# EAGLE design GAGAN_payload_V1 (EAGLE 9.3.2)
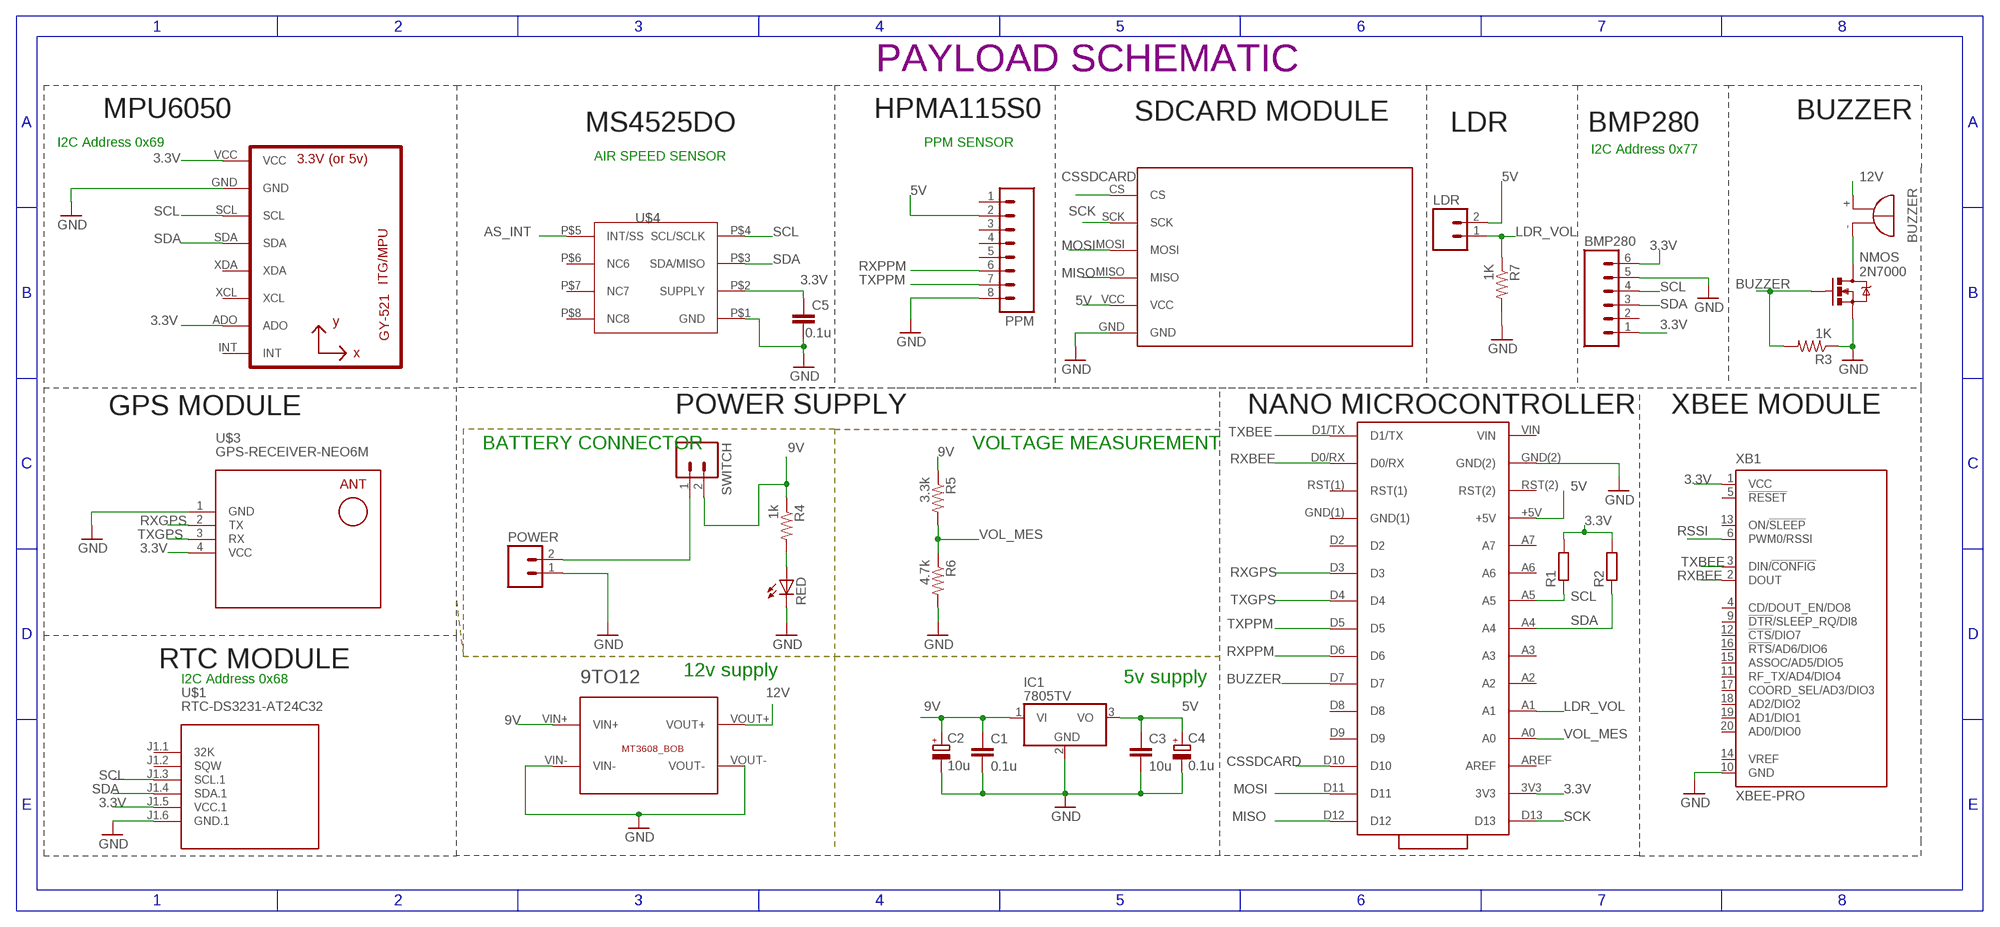
[diagram p0: schematic, sheet 1]

## Parts
9TO12  BREAKOUTS_MT3608_BOB  [BREAKOUTS_MT3608_BOB]
BMP280  M06  [06P]
C1  0.1u  C-EU025-025X050  [C025-025X050]
C2  10u  CPOL-EUE2.5-6  [E2,5-6]
C3  10u  C-EU025-025X050  [C025-025X050]
C4  0.1u  CPOL-EUE2.5-6  [E2,5-6]
C5  0.1u  C-EU025-025X050  [C025-025X050]
IC1  7805TV  [TO220V]
LDR  M02  [02P]
MOD1  ARDUINO(NANO_3.0)  [ARDUINO_NANO_30PIN]
POWER  CEDT_JANUARY_2015_V5_M02  [CEDT_JANUARY_2015_V5_02P]
PPM  M08  [08P]
Q1  SPARKFUN-DISCRETESEMI_MOSFET-NCHANNEL2N7000  [SPARKFUN-DISCRETESEMI_TO-92]
R1  R-EU_0207/7  [0207/7]
R2  R-EU_0207/7  [0207/7]
R3  1K  R-US_0204/7  [0204/7]
R4  1k  R-US_0204/7  [0204/7]
R5  3.3k  R-US_0204/7  [0204/7]
R6  4.7k  R-US_0204/7  [0204/7]
R7  1K  R-US_0204/7  [0204/7]
RED  red  LED3MM  [LED3MM]
SG1  BUZZER_EB2209A  [BUZZER_EB2209A]
SWITCH  M02  [02P]
U1  GY-521MPU6050  [GY-521]
U$1  RTC-DS3231-AT24C32  [RTC-DS3231-AT24C32]
U$3  GPS-RECEIVER-NEO6M  [GPS-RECEIVER-NEO6M]
U$4  MS4525DO  [MS4525DO]
U$5  SDCARD  [M0SDCARDMODULE]
XB1  XBEE-PRO  [XBEE-PRO]

## Nets
3.3V [power]: BMP280.1 BMP280.6 C5.1 MOD1.3V3 R1.2 R2.2 U1.ADO U1.VCC U$1.J1.5(VCC.1) U$3.4(VCC) U$4.P$2(SUPPLY) XB1.1(VCC)
5V [power]: C3.1 C4.+ IC1.3(VO) LDR.2 MOD1.+5V PPM.2 U$5.VCC
9V [power]: 9TO12.VIN+ C1.1 C2.+ IC1.1(VI) R4.1 R5.1 SWITCH.2
12V [power]: 9TO12.VOUT+ SG1.+
AS_INT: U$4.P$5(INT/SS)
BUZZER: MOD1.D7 Q1.2(G) R3.2
CSSDCARD: MOD1.D10 U$5.CS
GND [power]: 9TO12.VIN- 9TO12.VOUT- BMP280.5 C1.2 C2.- C3.2 C4.- C5.2 IC1.2(GND) MOD1.GND(2) POWER.1 PPM.8 Q1.1(S) R3.1 R6.2 R7.2 RED.K(C) U1.GND U$1.J1.6(GND.1) U$3.1(GND) U$4.P$1(GND) U$5.GND XB1.10(GND)
LDR_VOL: LDR.1 MOD1.A1 R7.1
MISO: MOD1.D12 U$5.MISO
MOSI: MOD1.D11 U$5.MOSI
N$1 [power]: POWER.2 SWITCH.1
N$2: R4.2 RED.A
N$3 [power]: Q1.3(D) SG1.-
RSSI: XB1.6(PWM0/RSSI)
RXBEE: MOD1.D0/RX XB1.2(DOUT)
RXGPS: MOD1.D3 U$3.2(TX)
RXPPM: MOD1.D6 PPM.6
SCK: MOD1.D13 U$5.SCK
SCL: BMP280.4 MOD1.A5 R1.1 U1.SCL U$1.J1.3(SCL.1) U$4.P$4(SCL/SCLK)
SDA: BMP280.3 MOD1.A4 R2.1 U1.SDA U$1.J1.4(SDA.1) U$4.P$3(SDA/MISO)
TXBEE: MOD1.D1/TX XB1.3(DIN/!CONFIG)
TXGPS: MOD1.D4 U$3.3(RX)
TXPPM: MOD1.D5 PPM.7
VOL_MES: MOD1.A0 R5.2 R6.1
Unconnected: BMP280.2 MOD1.A2 MOD1.A3 MOD1.A6 MOD1.A7 MOD1.AREF MOD1.D2 MOD1.D8 MOD1.D9 MOD1.GND(1) MOD1.RST(1) MOD1.RST(2) MOD1.VIN PPM.1 PPM.3 PPM.4 PPM.5 U1.INT U1.XCL U1.XDA U$1.J1.1(32K) U$1.J1.2(SQW) U$4.P$6(NC6) U$4.P$7(NC7) U$4.P$8(NC8) XB1.4(CD/DOUT_EN/DO8) XB1.5(!RESET) XB1.9(!DTR!/SLEEP_RQ/DI8) XB1.11(RF_TX/AD4/DIO4) XB1.12(!CTS!/DIO7) XB1.13(ON/!SLEEP) XB1.14(VREF) XB1.15(ASSOC/AD5/DIO5) XB1.16(!RTS!/AD6/DIO6) XB1.17(COORD_SEL/AD3/DIO3) XB1.18(AD2/DIO2) XB1.19(AD1/DIO1) XB1.20(AD0/DIO0)

## Notes on the sheet
- PAYLOAD SCHEMATIC
- MPU6050 | HPMA115S0 | SDCARD MODULE | BUZZER
- MS4525DO | LDR | BMP280
- I2C Address 0x69 | PPM SENSOR
- I2C Address 0x77
- AIR SPEED SENSOR
- GPS MODULE | POWER SUPPLY | NANO MICROCONTROLLER | XBEE MODULE
- BATTERY CONNECTOR | VOLTAGE MEASUREMENT
- RTC MODULE
- 12v supply
- I2C Address 0x68 | 5v supply

## Library data of the parts
9TO12 = Cansat2019_3279_Container_v01:BREAKOUTS_MT3608_BOB
BMP280 = con-amp-quick:M06: AMP QUICK CONNECTOR; OC_FARNELL: unknown; OC_NEWARK: unknown
C1 C3 C5 = resistor:C-EU: CAPACITOR, European symbol
C2 C4 = rcl:CPOL-EU: POLARIZED CAPACITOR, European symbol
IC1 = linear:78*: Positive VOLTAGE REGULATOR Source: http://cache.national.com/ds/LM/LM78L05.pdf http://www.fairchildsemi.com/ds/LM/LM7805.pdf
LDR = con-amp-quick:M02: AMP QUICK CONNECTOR; OC_FARNELL: unknown; OC_NEWARK: unknown
MOD1 = Arduino_Nano_3:ARDUINO(NANO_3.0)
POWER = Cansat2019_3279_Container_v01:CEDT_JANUARY_2015_V5_M02: AMP QUICK CONNECTOR
PPM = con-amp-quick:M08: AMP QUICK CONNECTOR; OC_FARNELL: unknown; OC_NEWARK: unknown
Q1 = Cansat2019_3279_Container_v01:SPARKFUN-DISCRETESEMI_MOSFET-NCHANNEL: Common NMOSFET Parts MFG P/N Store ID Prod ID FDD8780 TRANS-09984 SI7820DN TRANS-11055 FDS6630A IC-08089 2N7002PW TRANS-11151 FQP30N06L COM-10213 TRANS-10060 BSS123LT1G TRANS-08345 BSS138 TRANS-00830 BS170 2N7000
R1 R2 = rcl:R-EU_: RESISTOR, European symbol; SPICEPREFIX: R
R3-R7 = rcl:R-US_: RESISTOR, American symbol
RED = CEDT_JANUARY_2015_v5:LED
SG1 = Cansat2019_3279_Container_v01:BUZZER_EB2209A: BUZZER Source: Buerklin; OC_FARNELL: unknown; OC_NEWARK: unknown
SWITCH = CEDT_JANUARY_2015_v5:M02: AMP QUICK CONNECTOR
U1 = gy-521:GY-521
U$1 = diy-modules:RTC-DS3231-AT24C32: RTC Module with Battery and EEPROM based on DS3231 and AT24C32 chips Tutorial can be found here: https://edwardmallon.wordpress.com/2014/05/21/using-a-cheap-3-ds3231-rtc-at24c32-eeprom-from-ebay/ Click here to find device on ebay.com <http://www.ebay.com/sch/DS3231+AT24C32+module>
U$3 = diy-modules_modded_gps:GPS-RECEIVER-NEO6M: GPS Receiver Module based on NEO-6 device Short tutorial how to use NEO-6 module with Arduino: http://www.xarg.org/2016/06/neo6mv2-gps-module-with-arduino/ NEO-6 datasheet is available here: https://www.u-blox.com/sites/default/files/products/documents/NEO-6_DataSheet_%28GPS.G6-HW-09005%29.pdf Click here to find device on ebay.com <http://www.ebay.com/sch/gyneo6mv2>
U$4 = MS4525:MS4525DO
U$5 = mylib:SDCARD
XB1 = maxstream:XBEE: XBee (TM) /XBee-PRO(TM) OEM RF Modules Source: MaxStream, Inc. xbee_productmanual.pdf; MPN: XBP24-AWI-001; OC_FARNELL: 1337916; OC_NEWARK: 42M2667

## Net classes
0 default: width 0.61 mm
1 power: width 0.61 mm

## Board
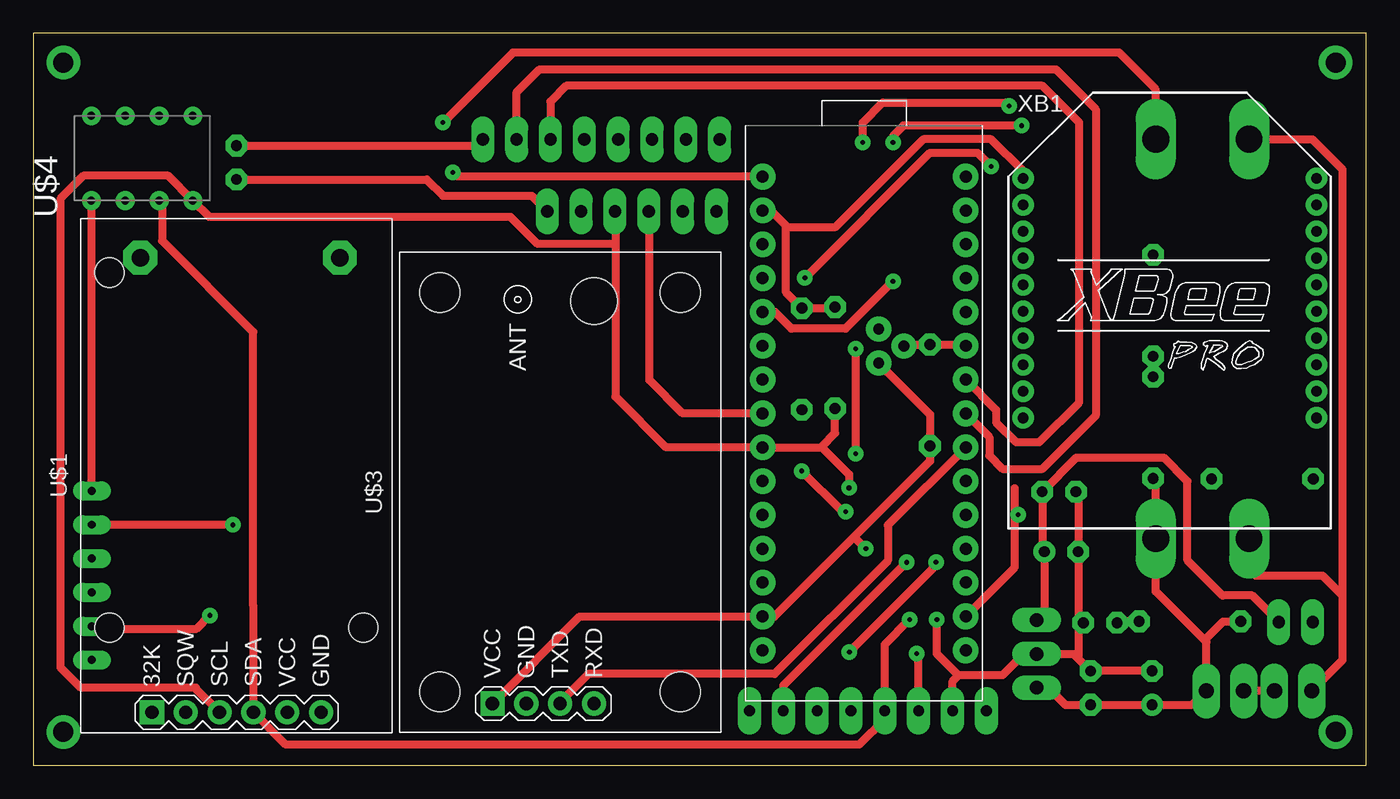
[diagram p1: board, top side]
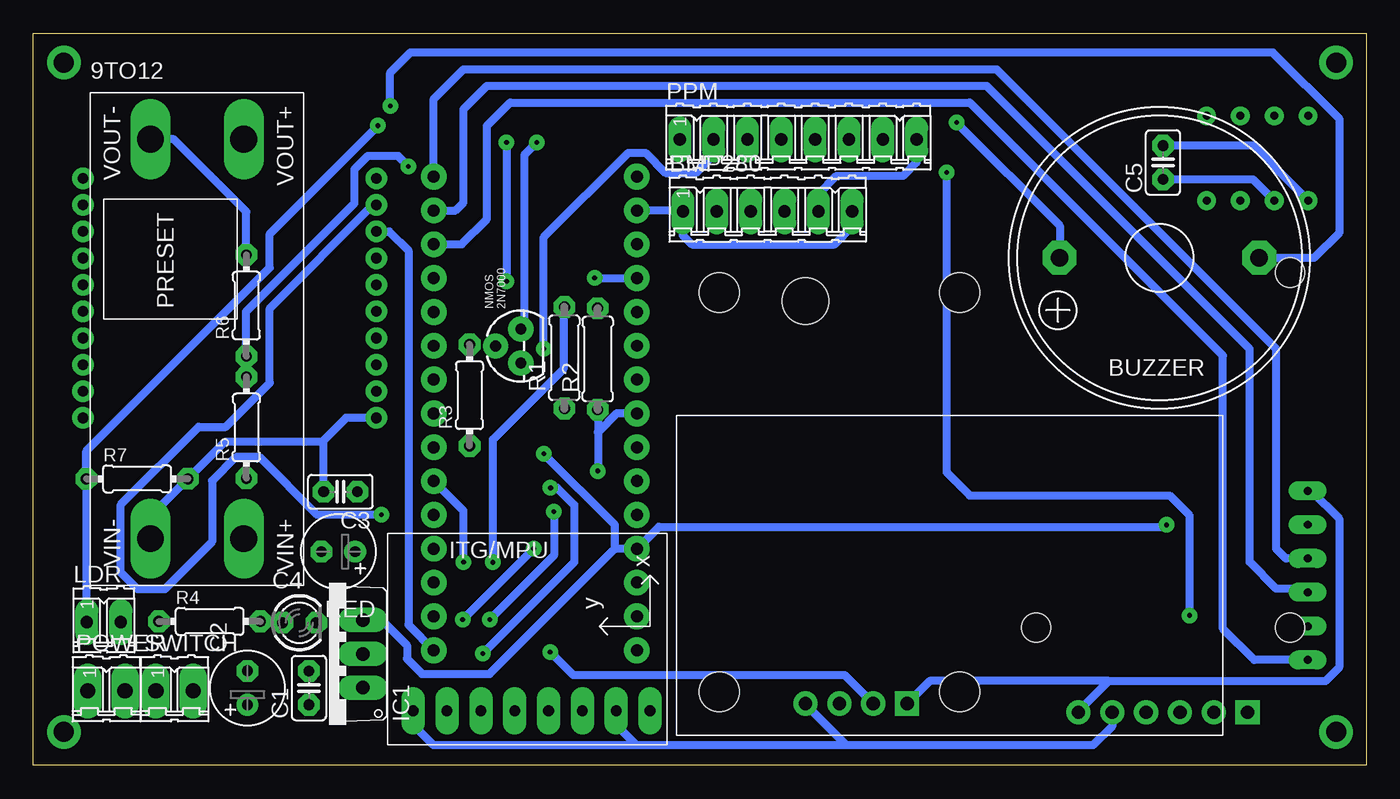
[diagram p2: board, bottom side, seen from below]

Size 100.04 x 54.95 mm. Coordinates in mm from the lower left corner, seen from the top.
Outline: 0,0 100.04,0 100.04,54.95 0,54.95 0,0
Copper layers (1*16): Top 0.035mm / dielectric 1.5mm / Bottom 0.035mm
Design rules "default *": minimum track width 6mil, minimum drill 0.35mm, track to track 16mil, track to pad 16mil, pad to pad 16mil, via to via 16mil, smd to smd 16mil, copper to edge 40mil, drill to drill 6mil, minimum pad ring 16mil, minimum via ring 16mil, stop-mask expansion 4mil, vias tented up to drill 0mil, thermal gap 10mil

### Footprints (pad centres in the part's own frame; a part is rotated, then mirrored left to right if it is on the bottom)
BREAKOUTS_MT3608_BOB = drill 2 pad 3 long: VIN+ 33.5,-4.5; VIN- 33.5,-11.5; VOUT+ 3.5,-4.5; VOUT- 3.5,-11.5
06P = drill 0.914 long: 1 -6.35,0; 2 -3.81,0; 3 -1.27,0; 4 1.27,0; 5 3.81,0; 6 6.35,0
C025-025X050 = drill 0.813 octagon: 1 -1.27,0; 2 1.27,0
E2,5-6 = drill 0.813 pad 1.6: + -1.27,0 | drill 0.813 pad 1.6 octagon: - 1.27,0
TO220V = drill 1.016 long: 1 -2.54,-2.54; 2 0,-2.54; 3 2.54,-2.54
02P = drill 0.914 long: 1 -1.27,0; 2 1.27,0
ARDUINO_NANO_30PIN = drill 0.9 pad 1.93: 3V3 16.51,6.35; +5V 16.51,31.75; A0 16.51,11.43; A1 16.51,13.97; A2 16.51,16.51; A3 16.51,19.05; A4 16.51,21.59; A5 16.51,24.13; A6 16.51,26.67; A7 16.51,29.21; AREF 16.51,8.89; D0/RX 1.27,36.83; D1/TX 1.27,39.37; D2 1.27,29.21; D3 1.27,26.67; D4 1.27,24.13; D5 1.27,21.59; D6 1.27,19.05; D7 1.27,16.51; D8 1.27,13.97; D9 1.27,11.43; D10 1.27,8.89; D11 1.27,6.35; D12 1.27,3.81; D13 16.51,3.81; GND(1) 1.27,31.75; GND(2) 16.51,36.83; RST(1) 1.27,34.29; RST(2) 16.51,34.29; VIN 16.51,39.37
CEDT_JANUARY_2015_V5_02P = drill 1.143 long: 1 -1.397,0; 2 1.397,0
08P = drill 0.914 long: 1 -8.89,0; 2 -6.35,0; 3 -3.81,0; 4 -1.27,0; 5 1.27,0; 6 3.81,0; 7 6.35,0; 8 8.89,0
SPARKFUN-DISCRETESEMI_TO-92 = drill 0.813 pad 1.88: 1 -1.27,0; 2 0,1.905; 3 1.27,0
0207/7 = drill 0.813 octagon: 1 -3.81,0; 2 3.81,0
0204/7 = drill 0.813 octagon: 1 -3.81,0; 2 3.81,0
LED3MM = drill 0.813 octagon: A -1.27,0; K 1.27,0
BUZZER_EB2209A = drill 1.321 pad 2.54 octagon: + 7.493,0; - -7.493,0
02P' = drill 1.143 long: 1 -1.397,0; 2 1.397,0
GY-521 = drill 0.8 pad 1.778 long: ADO -8.89,-6.35; GND -8.89,6.35; INT -8.89,-8.89; SCL -8.89,3.81; SDA -8.89,1.27; VCC -8.89,8.89; XCL -8.89,-3.81; XDA -8.89,-1.27
RTC-DS3231-AT24C32 = drill 1 square: J1.1 -17.78,6.35 | drill 1: J1.2 -17.78,3.81; J1.3 -17.78,1.27; J1.4 -17.78,-1.27; J1.5 -17.78,-3.81; J1.6 -17.78,-6.35 | hole 2.2: -11.43,-9.525; -11.43,9.525; 15.24,9.525
GPS-RECEIVER-NEO6M = drill 1 square: 1 -15.875,5.08 | drill 1: 2 -15.875,2.54; 3 -15.875,0; 4 -15.875,-2.54 | hole 3: -14.986,9.017; -14.986,-9.017; 14.986,-9.017; 14.986,9.017 | hole 3.5: 14.351,-2.54
MS4525DO = drill 0.6: P$1 -6.35,8.89; P$2 -6.35,6.35; P$3 -6.35,3.81; P$4 -6.35,1.27; P$5 0,8.89; P$6 0,6.35; P$7 0,3.81; P$8 0,1.27
M0SDCARDMODULE = drill 0.6 long: CS -6.35,6.35; GND -6.35,-6.35; MISO -6.35,-1.27; MOSI -6.35,1.27; SCK -6.35,3.81; VCC -6.35,-3.81
XBEE-PRO = drill 0.8 pad 1.27: 1 -11,9; 2 -11,7; 3 -11,5; 4 -11,3; 5 -11,1; 6 -11,-1; 7 -11,-3; 8 -11,-5; 9 -11,-7; 10 -11,-9; 11 11,-9; 12 11,-7; 13 11,-5; 14 11,-3; 15 11,-1; 16 11,1; 17 11,3; 18 11,5; 19 11,7; 20 11,9

### Placement (x,y rotation side)
9TO12  79.75,50.5 270 bottom
BMP280  44.93,41.58 0 bottom
C1  79.35,5.8 90 bottom
C2  83.97,5.81 90 bottom
C3  76.99,20.53 180 bottom
C4  77.15,16.03 180 bottom
C5  15.25,45.25 90 bottom
IC1  77.84,8.36 90 bottom
LDR  94.75,10.75 0 bottom
MOD1  71.25,48 180 top
POWER  94.55,5.58 0 bottom
PPM  42.63,46.99 0 bottom
Q1  63.45,31.47 90 bottom
R1  60.18,30.59 90 bottom
R2  57.68,30.5 90 bottom
R3  67.3,27.78 90 bottom
R4  86.81,10.8 0 bottom
R5  84.05,25.35 90 bottom
R6  84.05,34.51 90 bottom
R7  92.25,21.5 0 bottom
RED  80.07,10.7 0 bottom
SG1  15.52,38.1 180 bottom
SWITCH  [02P']  89.44,5.58 0 bottom
U1  62.64,12.97 90 bottom
U$1  15.25,21.75 90 top
U$3  39.54,20.5 90 top
U$4  13.25,48.75 90 top
U$5  10.75,14.25 180 bottom
XB1  85.3,35.07 0 top

### Tracks (layer width: path | path; a pad name or v marks a point on that pad's centre or on a via)
3.3V  (via drill 0.35)
  Top 0.61: 56.5,40.4 56.5,35.49 R2.2 60.09,34.31 R1.2 | MOD1.3V3 55.35,41.65 56.5,40.5 56.5,40.4 | U1.ADO 56.29,5.98 v65.54,15.23 | 56.5,40.4 60.21,40.4 66.81,47 71.89,47 74.3,44.59 XB1.1 | C5.1 29.52,43.98 30.75,42.75 37.41,42.75 BMP280.6
  Bottom 0.61: v65.54,15.23 65.54,24.46 60.21,29.79 60.21,34.43 R1.2 | MOD1.3V3 51.35,41.65 BMP280.1 51.28,39.78 50.6,39.1 39.9,39.1 38.58,40.42 BMP280.6 | U$4.P$2 8.48,43.98 C5.1 | U$1.J1.5 19.06,2.94 20.5,1.5 39,1.5 | 39,1.5 42.08,4.58 U$3.4 | 39,1.5 54.75,1.5 | 54.75,1.5 56.29,3.04 U1.ADO | 54.75,1.5 70,1.5 71.53,3.03 U1.VCC
5V  (via drill 0.35)
  Top 0.61: IC1.3 75.88,11.48 C4.+ 75.72,16.19 C3.1 78.28,23.09 84.84,23.09 86.62,21.32 86.62,15.38 89.25,12.75 91.48,12.75 LDR.2 | v14.99,18.05 4.41,18.05 U$5.VCC | v61.73,23.38 v61.73,31.25
  Bottom 0.61: 56.39,16.24 56.4,16.24 65.79,6.85 70.87,6.85 70.87,6.87 72,8 72,9 73.9,10.9 IC1.3 | v61.73,31.25 61.73,39.64 55.38,45.99 54.11,45.99 52.58,44.46 50.3,44.46 48.98,45.79 PPM.2 | v61.73,23.38 56.39,18.05 56.39,16.24 | 56.39,16.24 MOD1.+5V 53.09,17.9 15.14,17.9 v14.99,18.05
9V
  Top 0.61: IC1.1 76.18,5.82 77.47,4.53 C1.1 C2.+ 87,4.54 SWITCH.2 88.04,9.25 | 88.04,9.25 88.04,9.54 89.3,10.8 R4.1 | 88.04,9.25 84.25,13.04 9TO12.VIN+ 84.25,21.34 R5.1
12V  (via drill 0.35)
  Top 0.61: 9TO12.VOUT+ 84.25,50.75 81.5,53.5 36,53.5 v30.75,48.25
  Bottom 0.61: v30.75,48.25 23,40.5 23,38.11 SG1.+
BUZZER
  Top 0.61: Q1.2 65.47,31.59 R3.2 69.88,31.59 MOD1.D7
CSSDCARD
  Bottom 0.61: MOD1.D10 67.89,39.11 66,41 66,48 64.25,49.75 29.75,49.75 10.75,30.75 10.75,10.25 8.4,7.9 U$5.CS
GND  (via drill 0.35)
  Top 0.61: C3.2 78.42,20.37 C4.- 78.42,10.4 78.46,10.36 | C2.- C1.2 78.46,7.96 | 78.46,7.96 78.06,8.36 IC1.2 74.36,8.36 72.75,6.75 69.45,6.75 | 78.46,7.96 78.46,10.36 | 78.46,10.36 RED.K | 61.6,17.14 67.3,22.83 R3.1 67.3,26.35 Q1.1 | v67.82,10.92 67.82,8.38 69.45,6.75 | 61.6,17.14 v62.49,16.25 | U$5.GND 4.4,42.36 U$4.P$1 | U1.GND 68.99,6.29 69.45,6.75 | 61.6,17.14 55.64,11.17 MOD1.GND(2) 41.01,11.17 U$3.1 | 9TO12.VOUT- 96,47 98.25,44.75 98.25,12.75 | POWER.1 98.25,7.88 98.25,12.75 | 98.25,12.75 96.75,14.25 91.75,14.25 91.25,14.75 9TO12.VIN- | C5.2 33.27,46.52 PPM.8
  Bottom 0.61: 19.31,6.33 3.05,6.33 2.04,7.35 2.04,18.52 4.11,20.6 U$5.GND | v62.49,16.25 v67.82,10.92 | R6.2 84.05,41.55 89.5,47 9TO12.VOUT- | U$4.P$1 8.48,46.52 C5.2 | U$1.J1.6 21.6,4.04 19.31,6.33 | 19.31,6.33 32.76,6.33 U$3.1 | BMP280.5 41.12,42.88 39.75,44.25 34.75,44.25 33.74,45.26 PPM.8 | C3.2 78.26,24.25 | XB1.10 76.57,26.07 78.26,24.38 78.26,24.25 | 78.26,24.25 85.69,24.25 R7.2 91.25,18.69 9TO12.VIN-
LDR_VOL  (via drill 0.35)
  Top 0.61: MOD1.A1 54.75,34.04 55.63,34.04 56.9,32.78 60.96,32.78 v64.52,36.33 | v64.52,46.75 64.52,47.24 65.3,48.02 v74.17,48.02
  Bottom 0.61: LDR.1 96.02,19.71 96.06,19.75 R7.1 96.06,23.59 82.3,37.35 82.3,39.89 v74.17,48.02 | v64.52,46.75 v64.52,36.33
MISO
  Bottom 0.61: MOD1.D12 69.98,50.02 67.75,52.25 27.75,52.25 6.75,31.25 6.75,16.25 6.02,15.52 U$5.MISO
MOSI
  Bottom 0.61: MOD1.D11 68.35,41.65 67.75,42.25 67.75,49.25 66,51 28.5,51 8.75,31.25 8.75,15.25 6.75,13.25 4.67,13.25 U$5.MOSI
N$1
  Top 0.61: POWER.2 SWITCH.1
N$2
  Top 0.61: R4.2 81.44,10.8 RED.A
N$3  (via drill 0.35)
  Top 0.61: v62.25,46.75 62.25,48.25 63.75,49.75 73,49.75 v73.25,49.5
  Bottom 0.61: SG1.- 3.9,38.1 2,40 2,48.5 7,53.5 71.75,53.5 73.25,52 v73.25,49.5 | Q1.3 63.2,32.99 63.2,45.8 v62.25,46.75
N$4  (via drill 1.5)
  other vias: 2.25,52.75
N$5  (via drill 1.5)
  other vias: 2.25,2.5
N$6  (via drill 1.5)
  other vias: 97.75,52.75
N$7  (via drill 1.5)
  other vias: 97.75,2.5
RXBEE  (via drill 0.35)
  Top 0.61: MOD1.D0/RX 73.66,14.85 73.66,18.81 | 73.66,18.81 73.66,20.81 | v73.92,18.81 73.66,18.81
  Bottom 0.61: v73.92,18.81 78.74,18.81 83.06,23.13 84.84,23.13 86.62,21.35 86.62,16.78 90.17,13.22 92.21,13.22 93.48,14.49 93.48,19.57 87.63,25.41 85.6,25.41 82.3,28.71 82.3,34.3 74.53,42.07 XB1.2
RXGPS  (via drill 0.35)
  Top 0.61: v61.25,8.5 67.75,15 v67.75,15.25
  Bottom 0.61: U$3.2 39.12,6.75 59.5,6.75 v61.25,8.5 | v67.75,15.25 67.75,19.1 MOD1.D3
RXPPM
  Top 0.61: MOD1.D6 72.25,26.68 72.25,25.75 73.75,24.25 75.5,24.25 78.5,27.25 78.5,48.25 75.75,51 40,51 38.82,49.82 PPM.6
SCK  (via drill 0.35)
  Top 0.61: MOD1.D13 31.81,44.19 v31.5,44.5 | U$5.SCK 4.59,10.25 12.25,10.25 v13.25,11.25
  Bottom 0.61: v31.5,44.5 31.5,22 29.75,20.25 14.75,20.25 13.25,18.75 v13.25,11.25
SCL  (via drill 0.35)
  Top 0.61: R1.1 60.18,24.93 59.15,23.9 | 59.15,23.9 59.12,23.87 MOD1.A5 47.5,23.87 43.69,27.68 43.69,39.13 | v61.22,20.82 61.22,21.83 59.15,23.9 | BMP280.4 43.69,41.55 43.69,39.13 | U$1.J1.3 12.2,5.75 12.2,5.82 3.56,5.82 2.04,7.35 2.04,42.54 3.75,44.25 10.13,44.25 U$4.P$4 13.2,41.18 35.8,41.18 37.85,39.13 43.69,39.13 | U1.SCL 66.45,8.23 v66.29,8.38
  Bottom 0.61: v66.29,8.38 59.44,15.23 59.44,19.55 60.71,20.82 v61.22,20.82
SDA  (via drill 0.35)
  Top 0.61: v60.97,19.04 60.72,19.04 v57.67,22.09 | BMP280.3 46.23,41.55 46.23,28.92 48.74,26.41 MOD1.A4 | v65.77,10.93 63.91,9.07 U1.SDA 63.91,3.47 61.98,1.54 18.95,1.54 U$1.J1.4 16.52,11.94 16.51,11.95 16.51,32.52 9.66,39.38 9.66,42.18 U$4.P$3
  Bottom 0.61: v65.77,10.93 60.97,15.74 v60.97,19.04 | 57.67,25 R2.1 | 57.67,25 v57.67,22.09 | MOD1.A4 56.26,26.41 57.67,25
TXBEE
  Bottom 0.61: MOD1.D1/TX 71.89,10.54 71.89,38.64 73.32,40.07 XB1.3
TXGPS
  Top 0.61: U$3.3 39.63,4.71 39.63,4.81 41.67,6.85 55.63,6.85 64.14,15.35 64.14,18.03 MOD1.D4
TXPPM
  Top 0.61: MOD1.D5 71.75,24.64 71.75,23.25 72.75,22.25 75.75,22.25 79.75,26.25 79.75,49.25 76.75,52.25 38,52.25 36.28,50.53 PPM.7
VOL_MES  (via drill 0.35)
  Top 0.61: v71.89,44.97 70.87,45.99 67.31,45.99 v57.92,36.59
  Bottom 0.61: v71.89,44.97 72.65,45.73 74.93,45.73 75.95,44.72 75.95,42.18 84.07,34.05 84.07,30.75 84.05,30.72 R6.1 R5.2 | v57.92,36.59 57.9,36.57 MOD1.A0